# EAGLE design main (EAGLE 9.6.2)
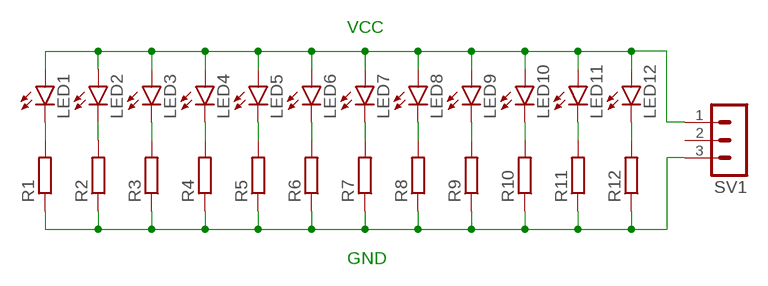
[diagram p0: schematic, sheet 1]

## Parts
LED1  LED10MM  [LED10MM]
LED2  LED10MM  [LED10MM]
LED3  LED10MM  [LED10MM]
LED4  LED10MM  [LED10MM]
LED5  LED10MM  [LED10MM]
LED6  LED10MM  [LED10MM]
LED7  LED10MM  [LED10MM]
LED8  LED10MM  [LED10MM]
LED9  LED10MM  [LED10MM]
LED10  LED10MM  [LED10MM]
LED11  LED10MM  [LED10MM]
LED12  LED10MM  [LED10MM]
R1  R-EU_0204/7  [0204/7]
R2  R-EU_0204/7  [0204/7]
R3  R-EU_0204/7  [0204/7]
R4  R-EU_0204/7  [0204/7]
R5  R-EU_0204/7  [0204/7]
R6  R-EU_0204/7  [0204/7]
R7  R-EU_0204/7  [0204/7]
R8  R-EU_0204/7  [0204/7]
R9  R-EU_0204/7  [0204/7]
R10  R-EU_0204/7  [0204/7]
R11  R-EU_0204/7  [0204/7]
R12  R-EU_0204/7  [0204/7]
SV1  MA03-1  [MA03-1]

## Nets
GND: R1.1 R2.1 R3.1 R4.1 R5.1 R6.1 R7.1 R8.1 R9.1 R10.1 R11.1 R12.1 SV1.3
N$2: LED1.K(C) R1.2
N$4: LED2.K(C) R2.2
N$5: LED3.K(C) R3.2
N$6: LED4.K(C) R4.2
N$7: LED5.K(C) R5.2
N$8: LED6.K(C) R6.2
N$9: LED7.K(C) R7.2
N$10: LED8.K(C) R8.2
N$11: LED9.K(C) R9.2
N$12: LED10.K(C) R10.2
N$13: LED11.K(C) R11.2
N$14: LED12.K(C) R12.2
VCC: LED1.A LED2.A LED3.A LED4.A LED5.A LED6.A LED7.A LED8.A LED9.A LED10.A LED11.A LED12.A SV1.1
Unconnected: SV1.2

## Notes on the sheet
- VCC
- GND

## Library data of the parts
LED1-LED12 = led:LED: LED OSRAM: - CHIPLED LG R971, LG N971, LY N971, LG Q971, LY Q971, LO R971, LY R971 LH N974, LH R974 LS Q976, LO Q976, LY Q976 LO Q996 - Hyper CHIPLED LW Q18S LB Q993, LB Q99A, LB R99A - SideLED LS A670, LO A670, LY A670, LG A670, LP A670 LB A673, LV A673, LT A673, LW A673 LH A674 LY A675 LS A676, LA A676, LO A676, LY A676, LW A676 LS A679, LY A679, LG A679 - Hyper Micro SIDELED® LS Y876, LA Y876, LO Y876, LY Y876 LT Y87S - SmartLED LW L88C, LW L88S LB L89C, LB L89S, LG L890 LS L89K, LO L89K, LY L89K LS L896, LA L896, LO L896, LY L896 - TOPLED LS T670, LO T670, LY T670, LG T670, LP T670 LSG T670, LSP T670, LSY T670, LOP T670, LYG T670 LG T671, LOG T671, LSG T671 LB T673, LV T673, LT T673, LW T673 LH T674 LS T676, LA T676, LO T676, LY T676, LB T676, LH T676, LSB T676, LW T676 LB T67C, LV T67C, LT T67C, LS T67K, LO T67K, LY T67K, LW E67C LS E67B, LA E67B, LO E67B, LY E67B, LB E67C, LV E67C, LT E67C LW T67C LS T679, LY T679, LG T679 LS T770, LO T770, LY T770, LG T770, LP T770 LB T773, LV T773, LT T773, LW T773 LH T774 LS E675, LA E675, LY E675, LS T675 LS T776, LA T776, LO T776, LY T776, LB T776 LHGB T686 LT T68C, LB T68C - Hyper Mini TOPLED® LB M676 - Mini TOPLED Santana® LG M470 LS M47K, LO M47K, LY M47K Source: http://www.osram.convergy.de LUXEON: - LUMILED® LXK2-PW12-R00, LXK2-PW12-S00, LXK2-PW14-U00, LXK2-PW14-V00 LXK2-PM12-R00, LXK2-PM12-S00, LXK2-PM14-U00 LXK2-PE12-Q00, LXK2-PE12-R00, LXK2-PE12-S00, LXK2-PE14-T00, LXK2-PE14-U00 LXK2-PB12-K00, LXK2-PB12-L00, LXK2-PB12-M00, LXK2-PB14-N00, LXK2-PB14-P00, LXK2-PB14-Q00 LXK2-PR12-L00, LXK2-PR12-M00, LXK2-PR14-Q00, LXK2-PR14-R00 LXK2-PD12-Q00, LXK2-PD12-R00, LXK2-PD12-S00 LXK2-PH12-R00, LXK2-PH12-S00 LXK2-PL12-P00, LXK2-PL12-Q00, LXK2-PL12-R00 Source: www.luxeon.com KINGBRIGHT: KA-3528ASYC Source: www.kingbright.com
R1-R12 = rcl:R-EU_: RESISTOR, European symbol; SPICEPREFIX: R
SV1 = con-lstb:MA03-1: PIN HEADER; OC_FARNELL: unknown; OC_NEWARK: unknown

## Board
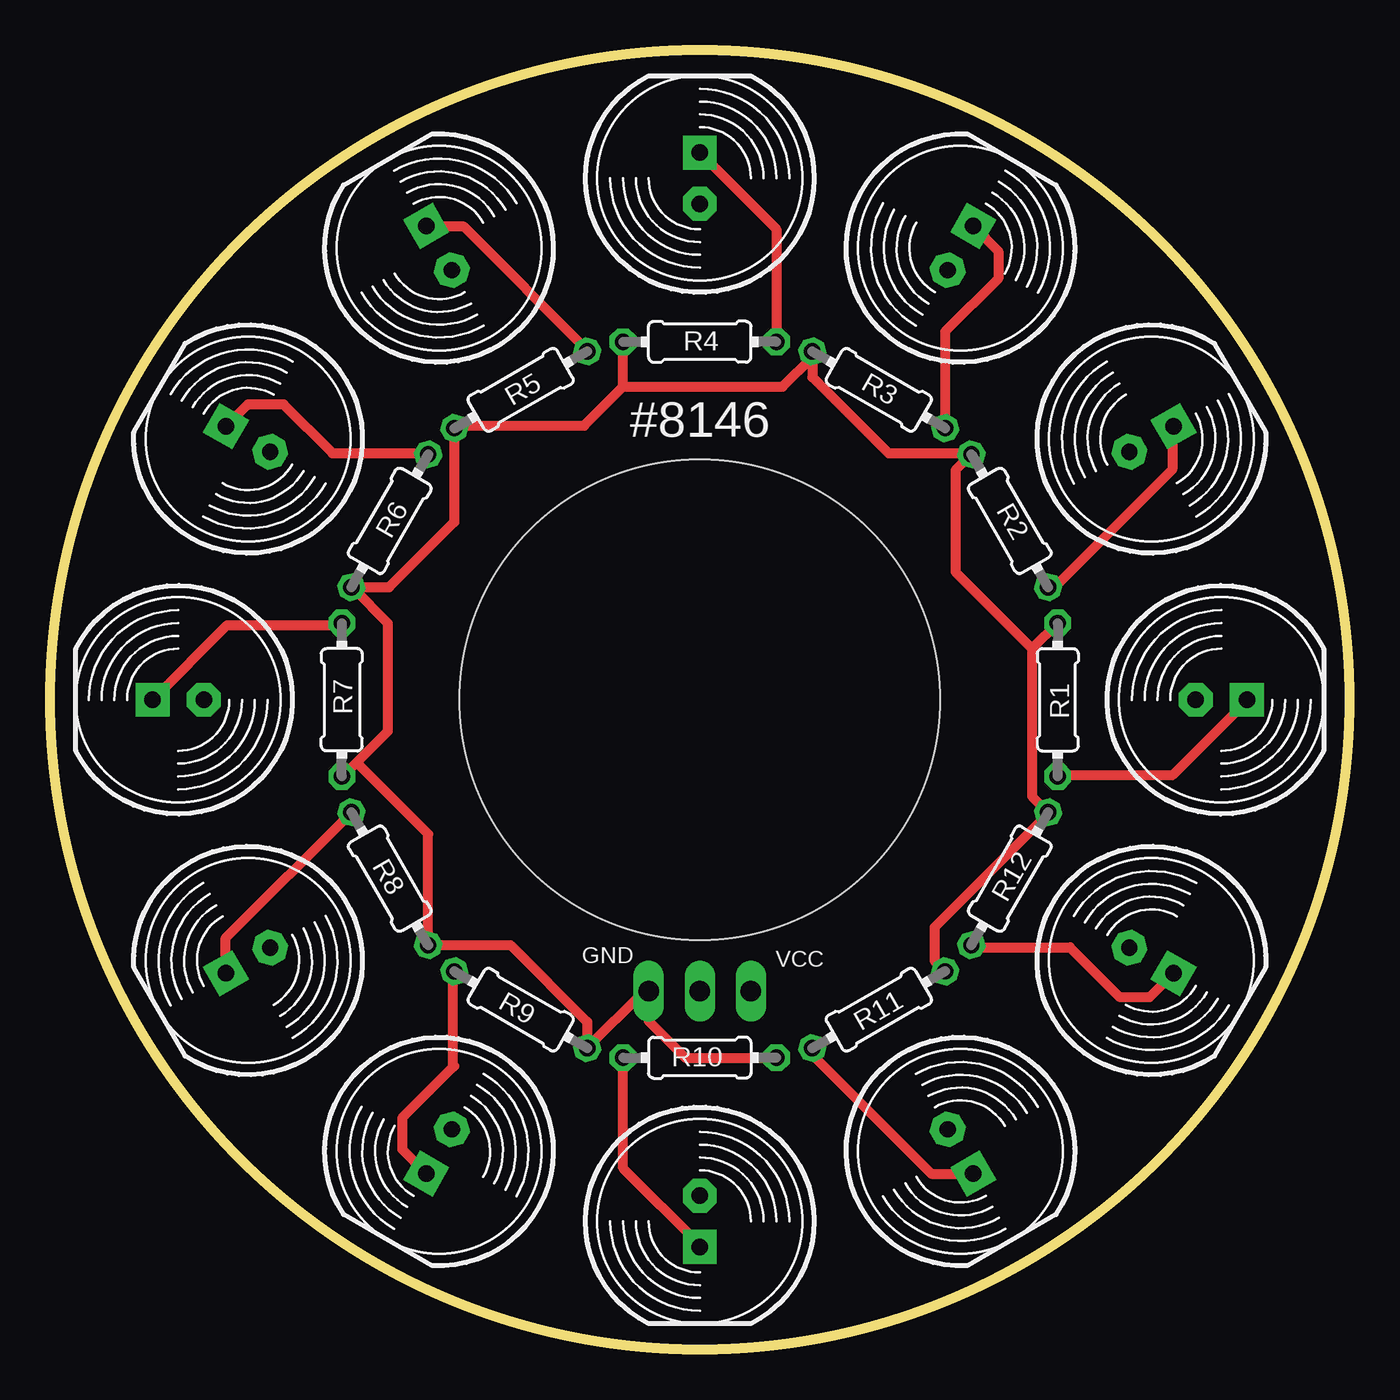
[diagram p1: board, top side]
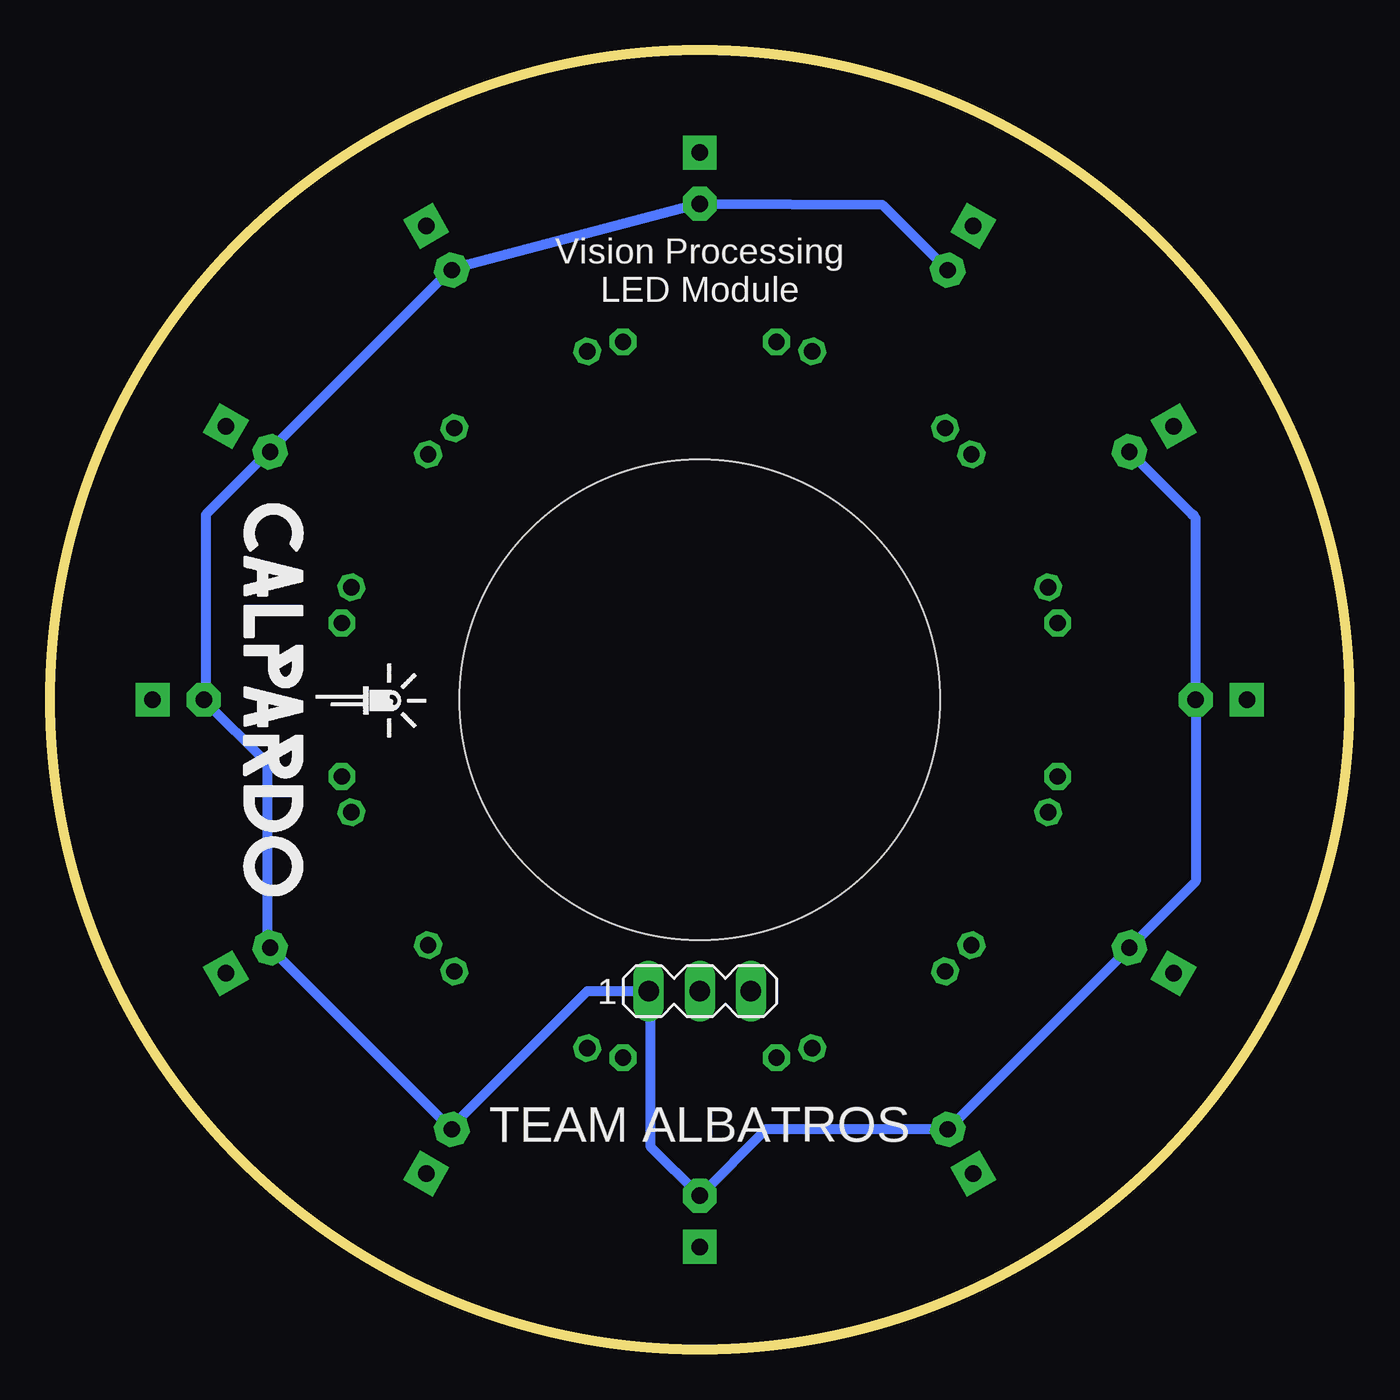
[diagram p2: board, bottom side, seen from below]

Size 64.52 x 64.52 mm. Coordinates in mm from the lower left corner, seen from the top.
Outline: circle at 32.26,32.26 radius 32.26
Copper layers (1*16): Top 0.035mm / dielectric 1.5mm / Bottom 0.035mm
Design rules "default": minimum track width 6mil, minimum drill 0.35mm, track to track 6mil, track to pad 6mil, pad to pad 6mil, via to via 6mil, smd to smd 6mil, copper to edge 40mil, drill to drill 6mil, minimum pad ring 10mil, minimum via ring 8mil, stop-mask expansion 4mil, vias tented up to drill 0mil, thermal gap 10mil
Holes 23.88 mm at 32.26,32.26

### Footprints (pad centres in the part's own frame; a part is rotated, then mirrored left to right if it is on the bottom)
LED10MM = drill 0.813 pad 1.676 octagon: A -1.27,0 | drill 0.813 pad 1.676 square: K 1.27,0
0204/7 = drill 0.813 octagon: 1 -3.81,0; 2 3.81,0
MA03-1 = drill 1.016 long: 1 -2.54,0; 2 0,0; 3 2.54,0

### Placement (x,y rotation side)
LED1  58.17,32.26 0 top
LED2  54.7,45.21 30 top
LED3  45.21,54.7 60 top
LED4  32.26,58.17 90 top
LED5  19.3,54.7 120 top
LED6  9.82,45.21 150 top
LED7  6.35,32.26 180 top
LED8  9.82,19.3 210 top
LED9  19.3,9.82 240 top
LED10  32.26,6.35 270 top
LED11  45.21,9.82 300 top
LED12  54.7,19.3 330 top
R1  50.04,32.26 270 top
R2  47.66,41.15 300 top
R3  41.15,47.66 330 top
R4  32.26,50.04 0 top
R5  23.37,47.66 30 top
R6  16.86,41.15 60 top
R7  14.48,32.26 90 top
R8  16.86,23.37 120 top
R9  23.37,16.86 150 top
R10  32.26,14.48 180 top
R11  41.15,16.86 210 top
R12  47.66,23.37 240 top
SV1  32.26,17.78 0 bottom

### Tracks (layer width: path | path; a pad name or v marks a point on that pad's centre or on a via)
GND
  Top 0.152: 49.48,26.52 R12.1 | 15.04,37.8 R6.1 | 20.07,45.72 R5.1 | 14.58,28.5 R7.1
  Top 0.508: R11.1 43.92,19.3 43.92,20.96 49.48,26.52 | 49.94,35.97 R1.1 48.77,34.8 | 49.48,26.67 R12.1 48.77,27.46 48.77,34.8 | R10.1 31.54,14.48 29.72,16.3 SV1.3 29.49,17.78 R9.1 26.67,16.26 22.86,20.07 R8.1 18.77,25.58 15.22,29.13 | 15.04,37.8 16.76,36.07 16.76,30.68 15.22,29.13 | 20.22,45.87 R5.1 20.19,45.87 20.22,45.87 | 28.45,47.8 36.37,47.8 37.85,49.28 R3.1 37.85,48.28 41.63,44.5 45.67,44.5 R2.1 44.96,43.66 44.96,38.61 48.77,34.8 | 28.45,47.8 R4.1 | R6.1 16.84,37.85 20.07,41.08 20.07,45.72 | 28.45,47.8 26.52,45.87 20.22,45.87 | 15.22,29.13 14.58,28.5
N$2
  Top 0.152: 50.09,28.5 R1.2
  Top 0.508: 50.09,28.5 55.73,28.5 59.39,32.16 LED1.K
N$4
  Top 0.508: R2.2 49.89,37.85 55.73,43.69 55.73,45.72 LED2.K
N$5
  Top 0.508: LED3.K 47.09,54.55 47.09,53.19 44.45,50.54 R3.2
N$6
  Top 0.508: R4.2 36.07,55.63 LED4.K
N$7
  Top 0.508: LED5.K 18.69,55.78 20.52,55.78 26.67,49.63 R5.2
N$8
  Top 0.508: R6.2 18.69,44.5 14.02,44.5 11.59,46.93 9.81,46.93 LED6.K
N$9
  Top 0.508: LED7.K 8.79,35.97 14.43,35.97 R7.2
N$10
  Top 0.508: R8.2 | LED8.K 8.72,20.43 R8.2
N$11
  Top 0.508: 20.02,14.02 17.48,11.48 17.48,9.92 LED9.K | 20.02,14.02 20.07,14.07 | 20.02,14.02 20.02,18.71 R9.2
N$12
  Top 0.508: R10.2 28.45,8.99 32.26,5.18 LED10.K
N$13
  Top 0.508: R11.2 37.85,14.63 43.38,9.09 43.76,8.72 LED11.K
N$14
  Top 0.508: LED12.K 54.6,17.48 53.14,17.48 50.65,19.96 45.86,19.96 R12.2
VCC
  Bottom 0.152: 53.59,19.81 LED12.A | 53.75,44.5 LED2.A | 7.72,32.31 LED7.A
  Bottom 0.508: 44.6,53.65 53.59,44.65 LED2.A | 44.6,53.65 LED3.A | 53.75,44.5 56.79,41.45 56.79,32.31 LED1.A 53.75,29.11 53.75,19.96 | 53.75,19.96 LED12.A | 53.75,19.96 53.62,19.96 LED11.A 44.58,11.05 37.85,17.78 SV1.1 34.7,17.68 34.7,10.06 LED10.A 28.96,10.92 LED9.A LED8.A 7.62,23.24 LED7.A 7.62,41.28 7.8,41.45 | LED5.A 23.19,56.85 LED4.A 44.6,53.65 | LED6.A 7.8,41.45 | 7.8,41.45 7.72,41.45

### Text on the board
tPlace: #8146 | GND | VCC
bPlace: Vision Processing | LED Module | TEAM ALBATROS